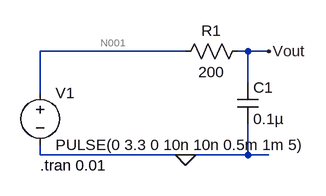
[diagram p0: schematic ESD_Switching.asc]
ESD_Switching.asc, the LTspice schematic file:
Version 4
SHEET 1 908 680
WIRE 192 112 -32 112
WIRE 288 112 272 112
WIRE 320 112 288 112
WIRE 288 160 288 112
WIRE -32 176 -32 112
WIRE -32 272 -32 256
WIRE 192 272 -32 272
WIRE 288 272 288 224
WIRE 288 272 192 272
WIRE 320 272 288 272
FLAG 192 272 0
FLAG 320 112 Vout
SYMBOL cap 272 160 R0
SYMATTR InstName C1
SYMATTR Value 0.1µ
SYMATTR SpiceLine Rser=1
SYMBOL res 176 128 R270
WINDOW 0 32 56 VTop 2
WINDOW 3 0 56 VBottom 2
SYMATTR InstName R1
SYMATTR Value 200
SYMBOL voltage -32 160 R0
WINDOW 123 0 0 Left 2
WINDOW 39 0 0 Left 2
SYMATTR InstName V1
SYMATTR Value PULSE(0 3.3 0 10n 10n 0.5m 1m 5)
TEXT -32 288 Left 2 !.tran 0.01

The netlist it stands for:
* ESD_Switching.asc
C1 Vout 0 0.1µ Rser=1
R1 N001 Vout 200
V1 N001 0 PULSE(0 3.3 0 10n 10n 0.5m 1m 5)
.tran 0.01
.backanno
.end

* Results of the author's LTspice run, read from the files saved beside the schematic
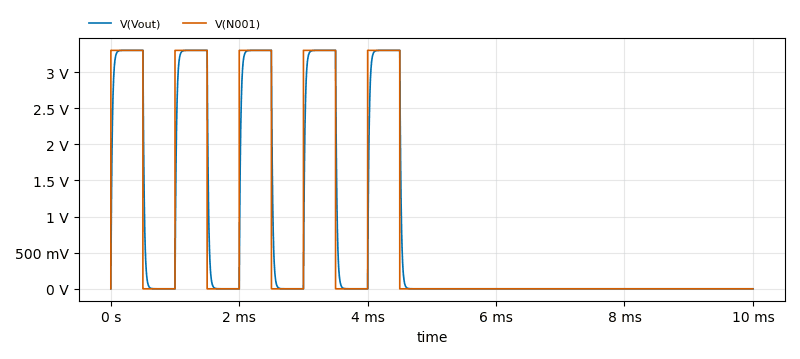
[diagram p1: Transient Analysis of ESD_Switching.asc, plotted from the saved traces]
* Transient Analysis, 1 run:
*   V(Vout): min 0 V, max 3.3 V, average 824.8 mV, rms 1.616 V, last 0 V
*   V(N001): min 0 V, max 3.3 V, average 825 mV, rms 1.65 V, last 0 V